# EAGLE design Parkingsensor (EAGLE 9.4.2)
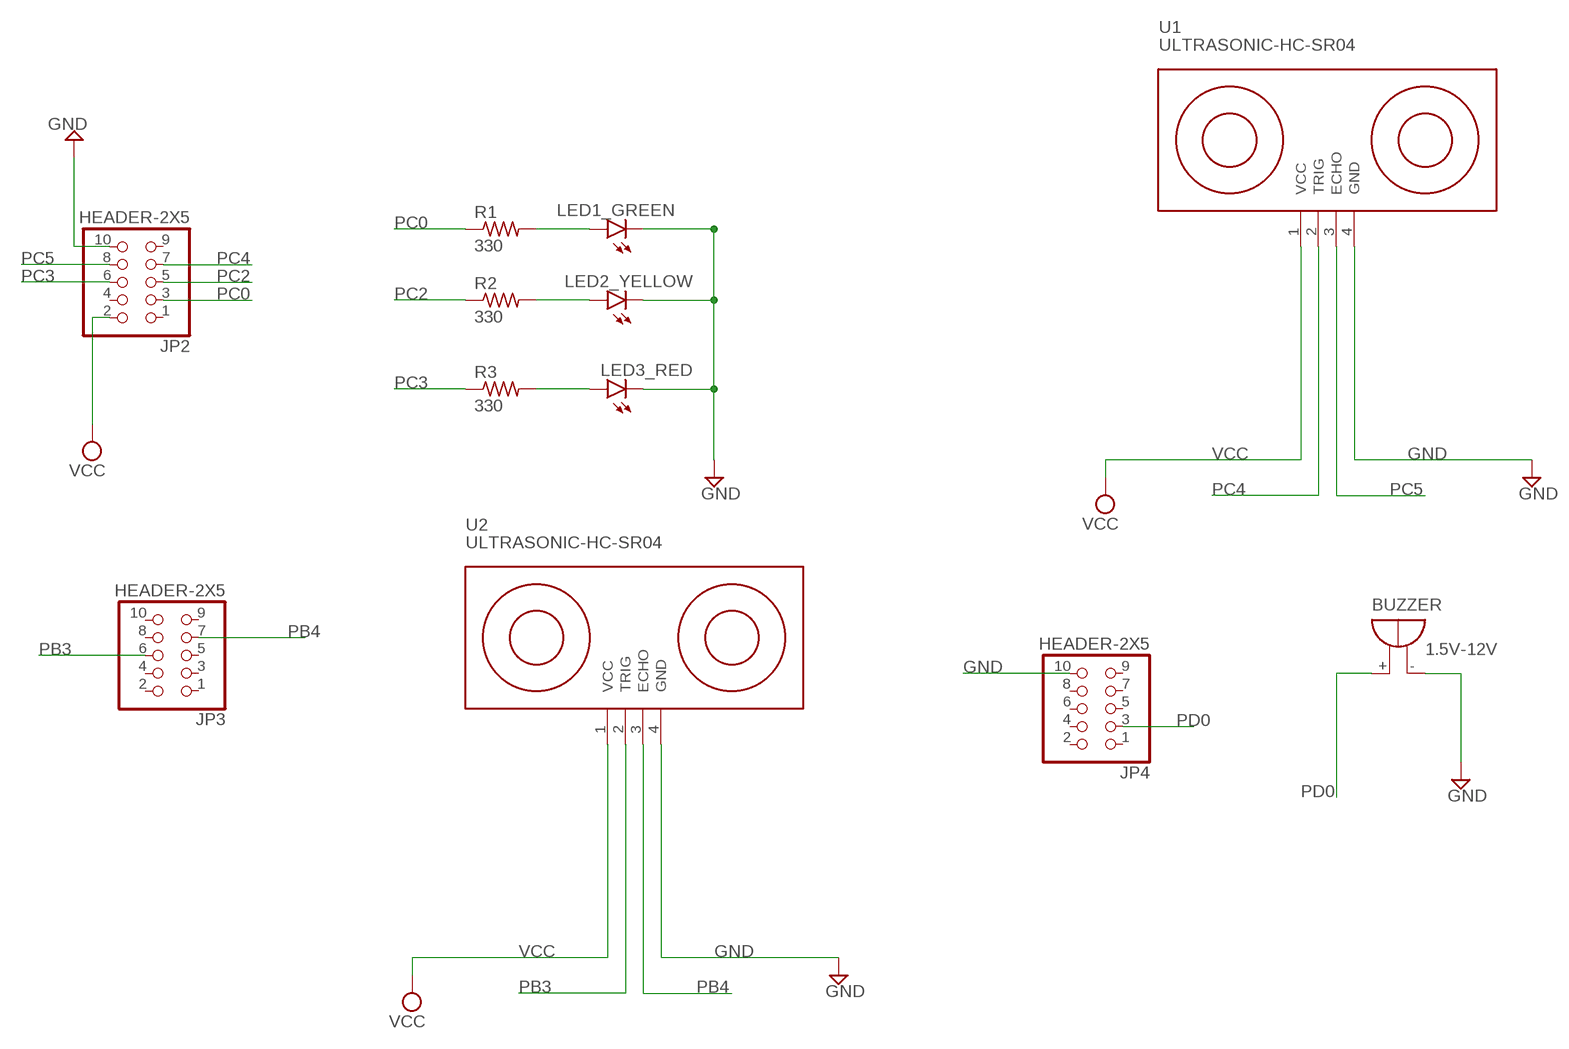
[diagram p0: schematic, sheet 1]

## Parts
BUZZER  1.5V-12V  EB2209A  [EB2209A]
JP2  HEADER-2X5  [2X05]
JP3  HEADER-2X5  [2X05]
JP4  HEADER-2X5  [2X05]
LED1_GREEN  LED3MM  [LED3MM]
LED2_YELLOW  LED3MM  [LED3MM]
LED3_RED  LED3MM  [LED3MM]
R1  330  R-US_0207/10  [0207/10]
R2  330  R-US_0207/10  [0207/10]
R3  330  R-US_0207/10  [0207/10]
U1  ULTRASONIC-HC-SR04  [ULTRASONIC-HC-SR04]
U2  ULTRASONIC-HC-SR04  [ULTRASONIC-HC-SR04]

## Nets
GND: BUZZER.- JP2.10 JP4.10 LED1_GREEN.K(C) LED2_YELLOW.K(C) LED3_RED.K(C) U1.4(GND) U2.4(GND)
N$1: LED1_GREEN.A R1.2
N$2: LED2_YELLOW.A R2.2
N$3: LED3_RED.A R3.2
PB3: JP3.6 U2.2(TRIG)
PB4: JP3.7 U2.3(ECHO)
PC0: JP2.3 R1.1
PC2: JP2.5 R2.1
PC3: JP2.6 R3.1
PC4: JP2.7 U1.2(TRIG)
PC5: JP2.8 U1.3(ECHO)
PD0: BUZZER.+ JP4.3
VCC: JP2.2 U1.1(VCC) U2.1(VCC)
Unconnected: JP2.1 JP2.4 JP2.9 JP3.1 JP3.2 JP3.3 JP3.4 JP3.5 JP3.8 JP3.9 JP3.10 JP4.1 JP4.2 JP4.4 JP4.5 JP4.6 JP4.7 JP4.8 JP4.9

## Library data of the parts
BUZZER = buzzer:EB2209A: BUZZER Source: Buerklin; OC_FARNELL: unknown; OC_NEWARK: unknown
JP2-JP4 = practicum:HEADER-2X5: 2x5 PIN HEADER Obtained from http://www.microbuilder.eu/Projects/EagleFootprintLibrary.aspx
LED1_GREEN LED2_YELLOW LED3_RED = led:LED: LED OSRAM: - CHIPLED LG R971, LG N971, LY N971, LG Q971, LY Q971, LO R971, LY R971 LH N974, LH R974 LS Q976, LO Q976, LY Q976 LO Q996 - Hyper CHIPLED LW Q18S LB Q993, LB Q99A, LB R99A - SideLED LS A670, LO A670, LY A670, LG A670, LP A670 LB A673, LV A673, LT A673, LW A673 LH A674 LY A675 LS A676, LA A676, LO A676, LY A676, LW A676 LS A679, LY A679, LG A679 - Hyper Micro SIDELED® LS Y876, LA Y876, LO Y876, LY Y876 LT Y87S - SmartLED LW L88C, LW L88S LB L89C, LB L89S, LG L890 LS L89K, LO L89K, LY L89K LS L896, LA L896, LO L896, LY L896 - TOPLED LS T670, LO T670, LY T670, LG T670, LP T670 LSG T670, LSP T670, LSY T670, LOP T670, LYG T670 LG T671, LOG T671, LSG T671 LB T673, LV T673, LT T673, LW T673 LH T674 LS T676, LA T676, LO T676, LY T676, LB T676, LH T676, LSB T676, LW T676 LB T67C, LV T67C, LT T67C, LS T67K, LO T67K, LY T67K, LW E67C LS E67B, LA E67B, LO E67B, LY E67B, LB E67C, LV E67C, LT E67C LW T67C LS T679, LY T679, LG T679 LS T770, LO T770, LY T770, LG T770, LP T770 LB T773, LV T773, LT T773, LW T773 LH T774 LS E675, LA E675, LY E675, LS T675 LS T776, LA T776, LO T776, LY T776, LB T776 LHGB T686 LT T68C, LB T68C - Hyper Mini TOPLED® LB M676 - Mini TOPLED Santana® LG M470 LS M47K, LO M47K, LY M47K Source: http://www.osram.convergy.de LUXEON: - LUMILED® LXK2-PW12-R00, LXK2-PW12-S00, LXK2-PW14-U00, LXK2-PW14-V00 LXK2-PM12-R00, LXK2-PM12-S00, LXK2-PM14-U00 LXK2-PE12-Q00, LXK2-PE12-R00, LXK2-PE12-S00, LXK2-PE14-T00, LXK2-PE14-U00 LXK2-PB12-K00, LXK2-PB12-L00, LXK2-PB12-M00, LXK2-PB14-N00, LXK2-PB14-P00, LXK2-PB14-Q00 LXK2-PR12-L00, LXK2-PR12-M00, LXK2-PR14-Q00, LXK2-PR14-R00 LXK2-PD12-Q00, LXK2-PD12-R00, LXK2-PD12-S00 LXK2-PH12-R00, LXK2-PH12-S00 LXK2-PL12-P00, LXK2-PL12-Q00, LXK2-PL12-R00 Source: www.luxeon.com KINGBRIGHT: KA-3528ASYC Source: www.kingbright.com
R1-R3 = rcl:R-US_: RESISTOR, American symbol; SPICEPREFIX: R
U1 U2 = diy-modules:ULTRASONIC-HC-SR04: Ultrasonic Ranging Module HC-SR04 More details available here: http://randomnerdtutorials.com/complete-guide-for-ultrasonic-sensor-hc-sr04/ Click here to find device on ebay.com <http://www.ebay.com/sch/hc+sr04+ultrasonic>

## Board
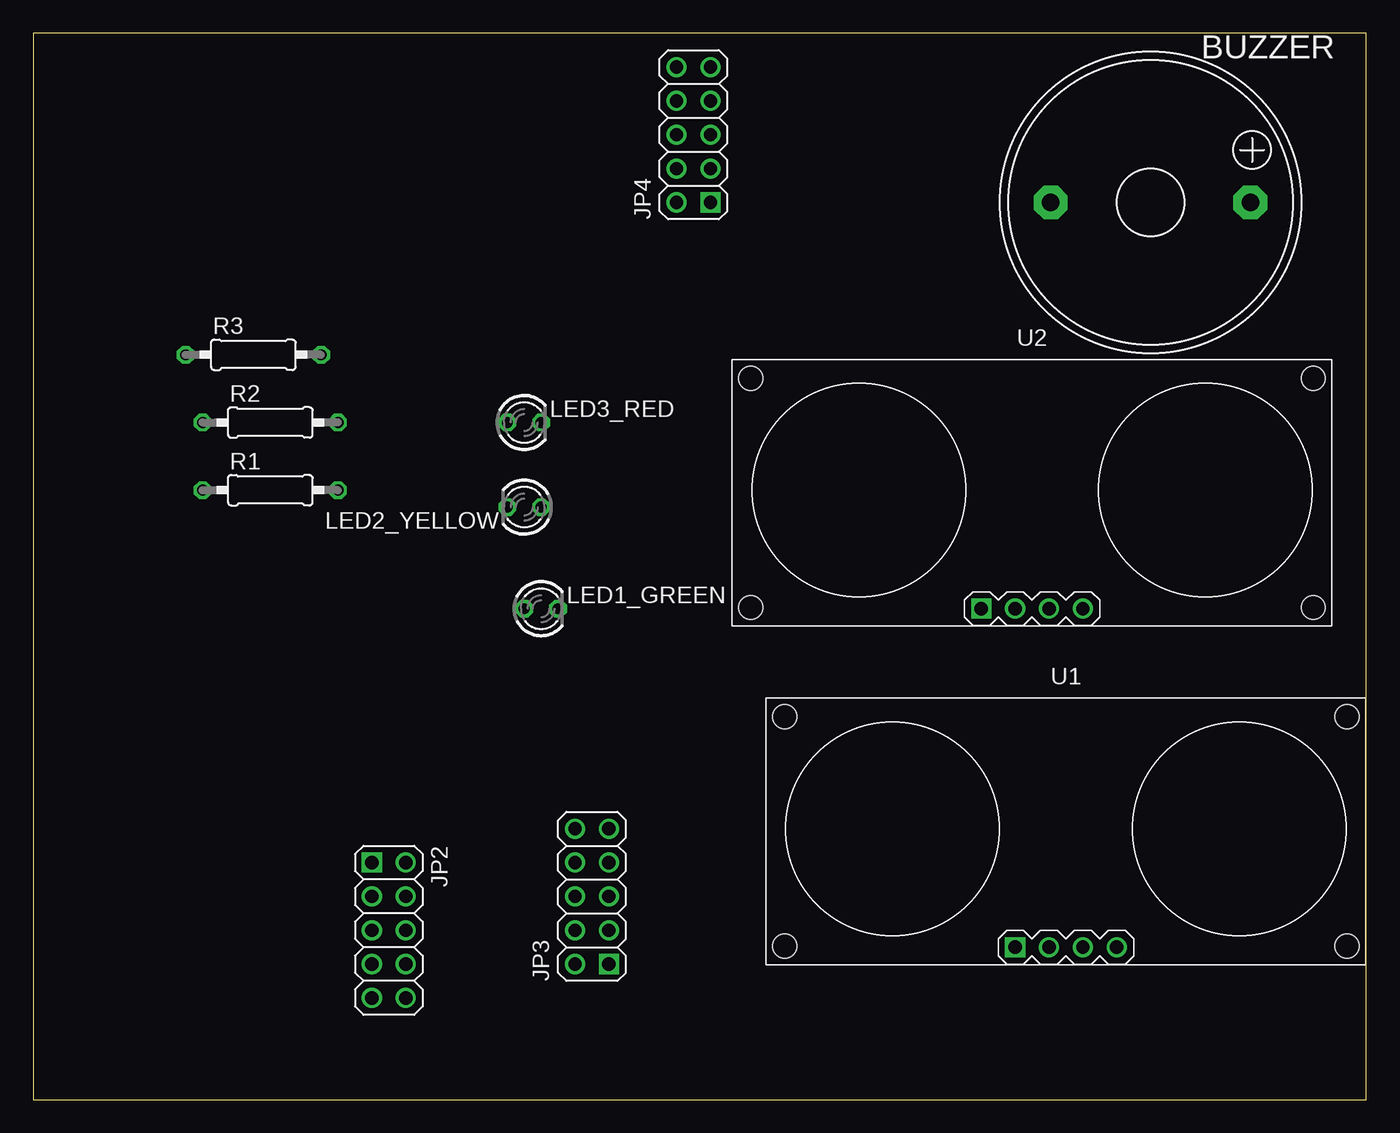
[diagram p1: board, top side]
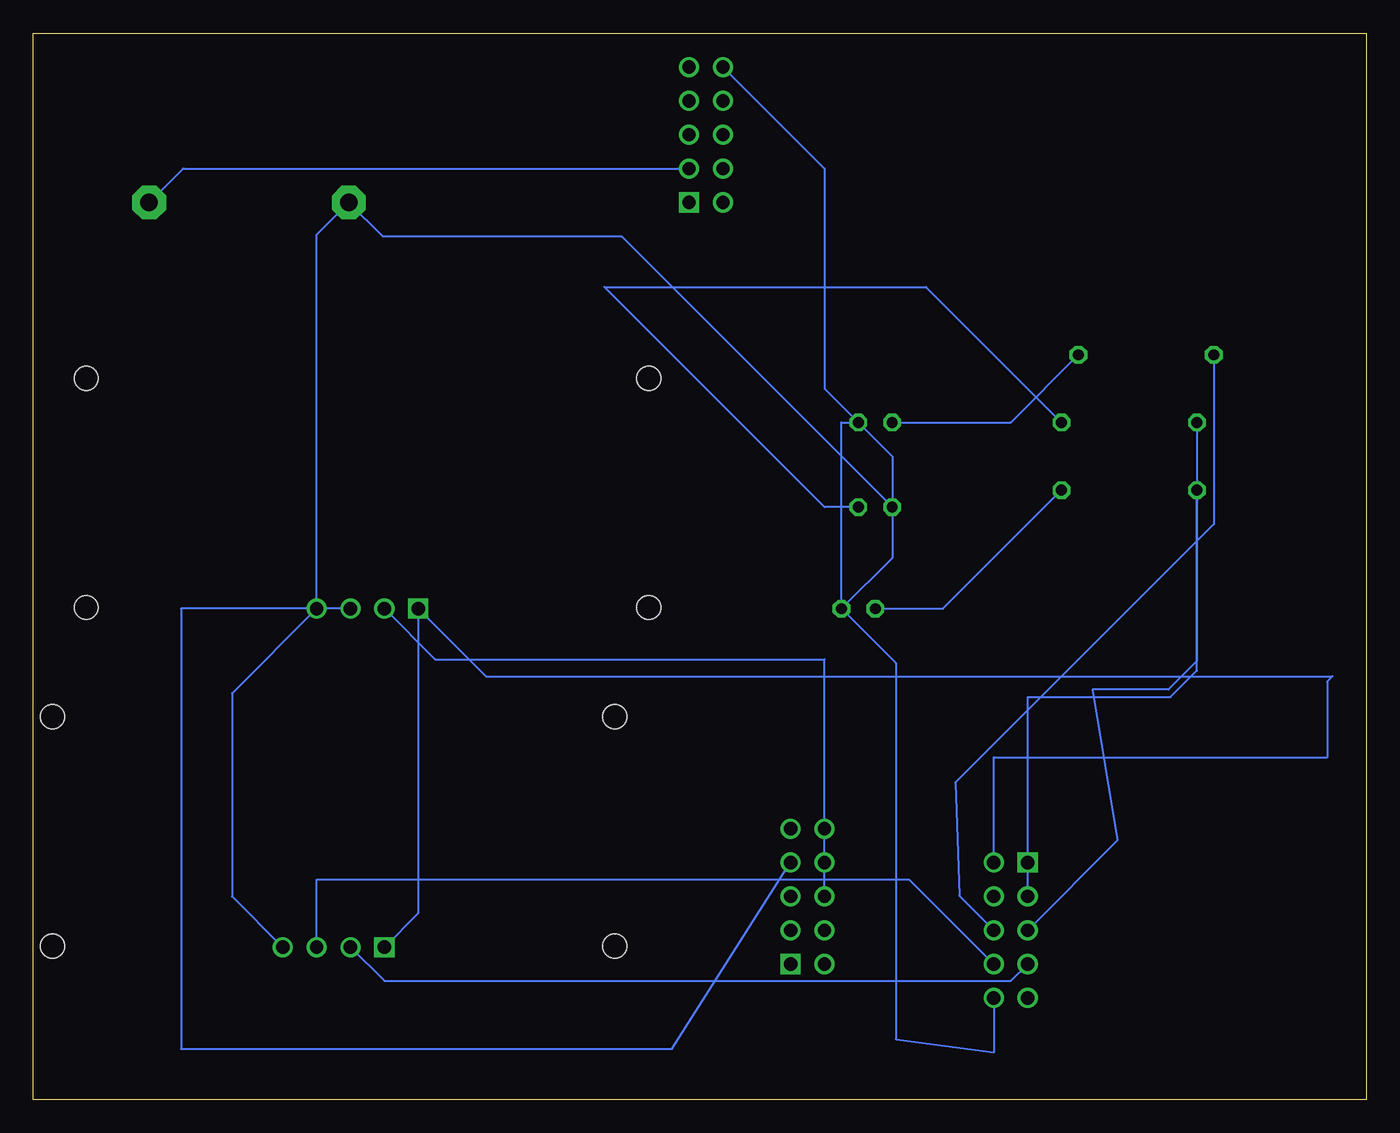
[diagram p2: board, bottom side, seen from below]

Size 100 x 80 mm. Coordinates in mm from the lower left corner, seen from the top.
Outline: 0,0 100,0 100,80 0,80 0,0
Copper layers (1*16): Top 0.035mm / dielectric 1.5mm / Bottom 0.035mm
Design rules "default": minimum track width 6mil, minimum drill 0.35mm, track to track 6mil, track to pad 6mil, pad to pad 6mil, via to via 6mil, smd to smd 6mil, copper to edge 40mil, drill to drill 6mil, minimum pad ring 10mil, minimum via ring 8mil, stop-mask expansion 4mil, vias tented up to drill 0mil, thermal gap 10mil

### Footprints (pad centres in the part's own frame; a part is rotated, then mirrored left to right if it is on the bottom)
EB2209A = drill 1.321 pad 2.54 octagon: + 7.493,0; - -7.493,0
2X05 = drill 1 square: 1 -5.08,-1.27 | drill 1: 2 -5.08,1.27; 3 -2.54,-1.27; 4 -2.54,1.27; 5 0,-1.27; 6 0,1.27; 7 2.54,-1.27; 8 2.54,1.27; 9 5.08,-1.27; 10 5.08,1.27
LED3MM = drill 0.813 octagon: A -1.27,0; K 1.27,0
0207/10 = drill 0.813 octagon: 1 -5.08,0; 2 5.08,0
ULTRASONIC-HC-SR04 = drill 1 square: 1 -3.81,-8.89 | drill 1: 2 -1.27,-8.89; 3 1.27,-8.89; 4 3.81,-8.89 | hole 1.8: -21.1,8.4; -21.1,-8.8; 21.1,-8.8; 21.1,8.4

### Placement (x,y rotation side)
BUZZER  83.82,67.31 0 top
JP2  26.67,12.7 270 top
JP3  41.91,15.24 90 top
JP4  49.53,72.39 90 top
LED1_GREEN  38.1,36.83 0 top
LED2_YELLOW  36.83,44.45 180 top
LED3_RED  36.83,50.8 0 top
R1  17.78,45.72 0 top
R2  17.78,50.8 0 top
R3  16.51,55.88 0 top
U1  77.47,20.32 0 top
U2  74.93,45.72 0 top

### Tracks (layer width: path | path; a pad name or v marks a point on that pad's centre or on a via)
GND
  Bottom 0.152: JP2.10 27.94,3.54 35.29,4.53 35.29,32.75 LED1_GREEN.K | LED3_RED.K 35.56,48.26 LED2_YELLOW.K | LED2_YELLOW.K 55.88,64.77 73.79,64.77 BUZZER.- 78.74,64.9 U2.4 85.09,30.48 85.09,15.24 U1.4 | LED1_GREEN.K 35.56,40.64 LED2_YELLOW.K | LED3_RED.K 39.37,50.8 LED1_GREEN.K | JP4.10 40.64,69.85 40.64,53.34 LED3_RED.K
N$1
  Bottom 0.152: LED1_GREEN.A 31.75,36.83 R1.2
N$2
  Bottom 0.152: R2.2 33.02,60.96 57.15,60.96 40.64,44.45 LED2_YELLOW.A
N$3
  Bottom 0.152: LED3_RED.A 26.67,50.8 R3.2
PB3
  Bottom 0.152: JP3.6 40.64,33.02 69.85,33.02 U2.2
PB4
  Bottom 0.152: U2.3 88.92,36.83 88.92,3.79 52.07,3.79 JP3.7
PC0
  Bottom 0.152: R1.1 12.7,32.18 14.69,30.19 25.38,30.19 25.4,30.18 JP2.3
PC2
  Bottom 0.152: JP2.5 18.67,19.43 20.53,30.77 14.83,30.77 12.7,32.9 R2.1
PC3
  Bottom 0.152: R3.1 11.43,43.18 30.83,23.78 30.53,15.29 JP2.6
PC4
  Bottom 0.152: U1.2 73.66,8.89 26.67,8.89 JP2.7
PC5
  Bottom 0.152: U1.3 78.74,16.51 34.29,16.51 JP2.8
PD0
  Bottom 0.152: JP4.3 88.77,69.85 BUZZER.+
VCC
  Bottom 0.152: U1.1 71.12,13.97 U2.1 66.04,31.75 2.53,31.75 2.92,31.36 2.92,25.69 27.94,25.69 JP2.2